# Altium schematic sheet External.SchDoc
size Letter; SheetNumber: 1; SheetTotal: 2
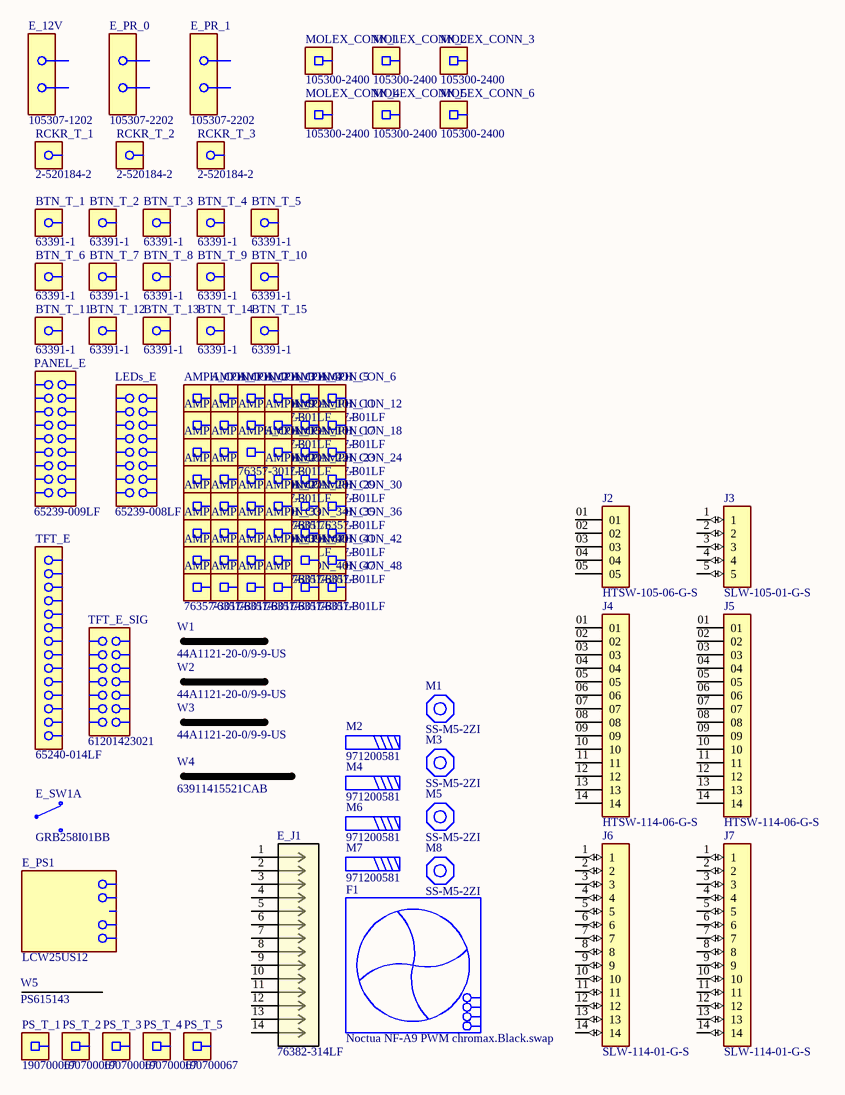
[diagram p0: External.SchDoc]

## Parts
AMPH_CON_1  76357-301LF  [76347-301LF-Footprint-1]
AMPH_CON_2  76357-301LF  [76347-301LF-Footprint-1]
AMPH_CON_3  76357-301LF  [76347-301LF-Footprint-1]
AMPH_CON_4  76357-301LF  [76347-301LF-Footprint-1]
AMPH_CON_5  76357-301LF  [76347-301LF-Footprint-1]
AMPH_CON_6  76357-301LF  [76347-301LF-Footprint-1]
AMPH_CON_7  76357-301LF  [76347-301LF-Footprint-1]
AMPH_CON_8  76357-301LF  [76347-301LF-Footprint-1]
AMPH_CON_9  76357-301LF  [76347-301LF-Footprint-1]
AMPH_CON_10  76357-301LF  [76347-301LF-Footprint-1]
AMPH_CON_11  76357-301LF  [76347-301LF-Footprint-1]
AMPH_CON_12  76357-301LF  [76347-301LF-Footprint-1]
AMPH_CON_13  76357-301LF  [76347-301LF-Footprint-1]
AMPH_CON_14  76357-301LF  [76347-301LF-Footprint-1]
AMPH_CON_15  76357-301LF  [76347-301LF-Footprint-1]
AMPH_CON_16  76357-301LF  [76347-301LF-Footprint-1]
AMPH_CON_17  76357-301LF  [76347-301LF-Footprint-1]
AMPH_CON_18  76357-301LF  [76347-301LF-Footprint-1]
AMPH_CON_19  76357-301LF  [76347-301LF-Footprint-1]
AMPH_CON_20  76357-301LF  [76347-301LF-Footprint-1]
AMPH_CON_21  76357-301LF  [76347-301LF-Footprint-1]
AMPH_CON_22  76357-301LF  [76347-301LF-Footprint-1]
AMPH_CON_23  76357-301LF  [76347-301LF-Footprint-1]
AMPH_CON_24  76357-301LF  [76347-301LF-Footprint-1]
AMPH_CON_25  76357-301LF  [76347-301LF-Footprint-1]
AMPH_CON_26  76357-301LF  [76347-301LF-Footprint-1]
AMPH_CON_27  76357-301LF  [76347-301LF-Footprint-1]
AMPH_CON_28  76357-301LF  [76347-301LF-Footprint-1]
AMPH_CON_29  76357-301LF  [76347-301LF-Footprint-1]
AMPH_CON_30  76357-301LF  [76347-301LF-Footprint-1]
AMPH_CON_31  76357-301LF  [76347-301LF-Footprint-1]
AMPH_CON_32  76357-301LF  [76347-301LF-Footprint-1]
AMPH_CON_33  76357-301LF  [76347-301LF-Footprint-1]
AMPH_CON_34  76357-301LF  [76347-301LF-Footprint-1]
AMPH_CON_35  76357-301LF  [76347-301LF-Footprint-1]
AMPH_CON_36  76357-301LF  [76347-301LF-Footprint-1]
AMPH_CON_37  76357-301LF  [76347-301LF-Footprint-1]
AMPH_CON_38  76357-301LF  [76347-301LF-Footprint-1]
AMPH_CON_39  76357-301LF  [76347-301LF-Footprint-1]
AMPH_CON_40  76357-301LF  [76347-301LF-Footprint-1]
AMPH_CON_41  76357-301LF  [76347-301LF-Footprint-1]
AMPH_CON_42  76357-301LF  [76347-301LF-Footprint-1]
AMPH_CON_43  76357-301LF  [76347-301LF-Footprint-1]
AMPH_CON_44  76357-301LF  [76347-301LF-Footprint-1]
AMPH_CON_45  76357-301LF  [76347-301LF-Footprint-1]
AMPH_CON_46  76357-301LF  [76347-301LF-Footprint-1]
AMPH_CON_47  76357-301LF  [76347-301LF-Footprint-1]
AMPH_CON_48  76357-301LF  [76347-301LF-Footprint-1]
BTN_T_1  63391-1  [63391-1-Footprint-1]
BTN_T_2  63391-1  [63391-1-Footprint-1]
BTN_T_3  63391-1  [63391-1-Footprint-1]
BTN_T_4  63391-1  [63391-1-Footprint-1]
BTN_T_5  63391-1  [63391-1-Footprint-1]
BTN_T_6  63391-1  [63391-1-Footprint-1]
BTN_T_7  63391-1  [63391-1-Footprint-1]
BTN_T_8  63391-1  [63391-1-Footprint-1]
BTN_T_9  63391-1  [63391-1-Footprint-1]
BTN_T_10  63391-1  [63391-1-Footprint-1]
BTN_T_11  63391-1  [63391-1-Footprint-1]
BTN_T_12  63391-1  [63391-1-Footprint-1]
BTN_T_13  63391-1  [63391-1-Footprint-1]
BTN_T_14  63391-1  [63391-1-Footprint-1]
BTN_T_15  63391-1  [63391-1-Footprint-1]
E_12V  105307-1202  [FP-105307-1202-MFG]
E_J1  76382-314LF  [76382-314LF_AMP]  (mechanical)
E_PR_0  105307-2202  [FP-105307-1202-MFG]
E_PR_1  105307-2202  [FP-105307-1202-MFG]
E_PS1  LCW25US12  [LCW25US12-Footprint-1]
E_SW1  GRB258I01BB  [GRB258I01BB-Footprint-1]  (part A of 2)
F1  Noctua NF-A9 PWM chromax.Black.swap  [Noctua NF-A9 PWM chromax.Black.swap-Footprint-1]
J2  HTSW-105-06-G-S  [SAMTEC_HTSW-105-06-G-S]  (mechanical)
J3  SLW-105-01-G-S  [SAMTEC-SLW-105-01-X-S]  (mechanical)
J4  HTSW-114-06-G-S  [SAMTEC_HTSW-114-06-G-S]  (mechanical)
J5  HTSW-114-06-G-S  [SAMTEC_HTSW-114-06-G-S]  (mechanical)
J6  SLW-114-01-G-S  [SAMTEC-SLW-114-01-X-S]  (mechanical)
J7  SLW-114-01-G-S  [SAMTEC-SLW-114-01-X-S]  (mechanical)
LEDs_E  65239-008LF  [65239-008LF-Footprint-1]
M1  SS-M5-2ZI  [SS-M5-2ZI-Footprint-1]
M2  971200581  [971400581-Footprint-1]
M3  SS-M5-2ZI  [SS-M5-2ZI-Footprint-1]
M4  971200581  [971400581-Footprint-1]
M5  SS-M5-2ZI  [SS-M5-2ZI-Footprint-1]
M6  971200581  [971400581-Footprint-1]
M7  971200581  [971400581-Footprint-1]
M8  SS-M5-2ZI  [SS-M5-2ZI-Footprint-1]
MOLEX_CONN_1  105300-2400  [105300-2400-Footprint-1]
MOLEX_CONN_2  105300-2400  [105300-2400-Footprint-1]
MOLEX_CONN_3  105300-2400  [105300-2400-Footprint-1]
MOLEX_CONN_4  105300-2400  [105300-2400-Footprint-1]
MOLEX_CONN_5  105300-2400  [105300-2400-Footprint-1]
MOLEX_CONN_6  105300-2400  [105300-2400-Footprint-1]
PANEL_E  65239-009LF  [65239-009LF-Footprint-1]
PS_T_1  190700067  [190700067-Footprint-1]
PS_T_2  190700067  [190700067-Footprint-1]
PS_T_3  190700067  [190700067-Footprint-1]
PS_T_4  190700067  [190700067-Footprint-1]
PS_T_5  190700067  [190700067-Footprint-1]
RCKR_T_1  2-520184-2  [9-520183-2-Footprint-1]
RCKR_T_2  2-520184-2  [9-520183-2-Footprint-1]
RCKR_T_3  2-520184-2  [9-520183-2-Footprint-1]
TFT_E  65240-014LF  [65240-014LF-Footprint-1]
TFT_E_SIG  61201423021  [61201423021-Footprint-1]
W1  44A1121-20-0/9-9-US  [44A1121-20-0_9-9-US-Footprint-1]
W2  44A1121-20-0/9-9-US  [44A1121-20-0_9-9-US-Footprint-1]
W3  44A1121-20-0/9-9-US  [44A1121-20-0_9-9-US-Footprint-1]
W4  63911415521CAB  [63911415521CAB-Footprint-1]
W5  PS615143  [PS615143-Footprint-1]

## Nets

Not connected (* = marked no-connect by the designer): E_J1 1 2 3 4 5 6 7 8 9 10 11 12 13 14; J2 01 02 03 04 05; J3 1 2 3 4 5; J4 01 02 03 04 05 06 07 08 09 10 11 12 13 14; J5 01 02 03 04 05 06 07 08 09 10 11 12 13 14; J6 1 2 3 4 5 6 7 8 9 10 11 12 13 14; J7 1 2 3 4 5 6 7 8 9 10 11 12 13 14

## Library data of the parts
AMPH_CON_1-AMPH_CON_48 = CMP-002-00102-1: Dubox® 2.54mm Pitch, Board to Board Connector, Crimp-to-Wire Contact; Voltage Rating: 1kV; Contact Resistance: 15mR; Max Current Rating: 3A; Wire Gauge (Min): 22AWG; Gender: Female; Wire/Cable Gauge: 30AWG; Connector Type: PCB,Crimp; Pitch: 2.54mm; Number of Rows: 1; Max Operating Temperature: 125°C; Length: 11.56mm; Lead Free: Lead Free; Radiation Hardening: No; RoHS Compliant: Yes; Orientation: Straight; Mounting Technology: Cable; Current Rating: 3A; Reach SVHC Compliant: Yes; Package Quantity: 15000; Wire Gauge (Max): 30AWG; Termination: Crimp; Series: DUBOX; Contact Plating: Gold,Tin,Matte; Contact Material: Bronze; Min Operating Temperature: -40°C; Contact Type: Signal; Packaging: Tape and Reel
BTN_T_1-BTN_T_15 = CMP-00008-1: Quick Disconnect Terminal 18-22AWG RCP 12.19mm 3.3mm Pre-Tin Loose Piece; Tab Thickness: 0.01inch; Tab Width: 0.093inch; Tab Length: 0.19inch; Insulation: Non-Insulated; Wire/Cable Diameter: 0.085inch; Plating: Tin; Wire Gauge (Max): 22AWG; Insulated Wire Support: Yes; Wire Gauge (Min): 18AWG; Wire/Cable Gauge: -18AWG; Wire/Cable Type: Discrete; Gender: Female; Contact Gender: Male; Radiation Hardening: No; Contact Plating: Tin; Series: Budget; Width: 3.05mm; Mating Tab Width: 0.093inch; Packaging: Bag; Orientation: Straight; RoHS Compliant: Yes; ELV: Compliant; Terminal Material: Brass; Material: Brass; Package Quantity: 1000; Mounting Technology: Free Hanging; Termination: Receptacle; Length: 12.19mm; Insulation Diameter: 0.085inch; Lead Free: Not Applicable
E_12V = CMP-002-00116-3: Nano-Fit Receptacle Housing; TPA Capable; 2.50mm Pitch; Single Row; 2 Circuit; Black; Number of Positions: 2; Color: Black; Gender: Receptacle; Series: Nano-Fit 105307; Contact Type: Non-Gendered; Packaging: Bulk; Connector Type: Receptacle; RoHS Compliant: Yes; Mounting Technology: Free Hanging; Termination: Crimp; Fastening Type: Latch; Number of Rows: 1
E_J1 = CMP-558-000000-2: Dubox®2.54mm, Board to Board Connector, Shrouded Header, Single Row, Right Angle.; Mfr_Name: Amphenol ICC; Contact Post Length: 3.4mm; Pitch: 2.54mm; Voltage Rating: 1kV; Connector Type: Male Pin; Number of Positions: 14; Gender: Male; Current Rating: 3A; Copyright: Copyright (C) 2023 Ultra Librarian. All rights reserved.; Contact Plating: Gold,GXT; Package Quantity: 16; Contact Mating Length: 0.197inch; Width: 9.34mm; Manufacturer_Part_Number: 76382-314LF; Number of Rows: 1; Fastening Type: Friction; Series: DUBOX™, MezzSelect™, Basics+; Mounting Technology: Through Hole; Contact Type: Male Pin; Packaging: Rail/Tube; Contact Material: Bronze; Design Item ID: 76382-314LF; Termination: Solder; Max Operating Temperature: 125°C; Length: 35.38mm; Color: Blue; Housing Color: Blue; RefDes: RefDes; Source: 76382-314LF.SchLib; Max Voltage Rating (AC): 1kV; Type: DEV; RoHS Compliant: Yes; Lead Free: Lead Free; Number of Contacts: 14; Radiation Hardening: No; Orientation: Right Angle; Min Operating Temperature: -40°C; Housing Material: Thermoplastic
E_PR_0 E_PR_1 = CMP-002-00117-2: Nano-Fit Receptacle Housing TPA Capable 2.5mm Pitch Single Row 2 Circuits Natural Bag; Connector Type: Receptacle,Non-Gendered; Number of Positions: 2; Color: Natural; Contact Type: Non-Gendered; Termination: Crimp; Fastening Type: Latch; RoHS Compliant: Yes; Number of Rows: 1; Packaging: Bulk; Gender: Receptacle; Mounting Technology: Free Hanging; Series: Nano-Fit 105307
E_PS1 = CMP-019-00052-1: Power Supply, AC-DC, Enclosed, Industrial, 25W, 12V, LCW25 Series
E_SW1 = CMP-011-00015-1: Rocker Switch, GRB, SPDT, (ON)-OFF-(ON), Convex, Black, IP56, 20A, 125VAC, .250" QC; Voltage Rating (AC): 125V; Mechanical Life: 100000Cycles; Switch Function: Mom-Off-Mom; Ratings: IP56,Water Resistant; Illumination Type: Illuminated; Mounting Technology: Panel,Snap in; Package Quantity: 1000; RoHS Compliant: Yes; Max Operating Temperature: 85°C; Termination: Quick Connect; Min Operating Temperature: -20°C; Series: GRB; Packaging: Bulk; Current Rating: 20A; Throw Configuration: SPDT
F1 = CMP-00030-00001-3: Premium quiet fan, 92x92x25mm, 12V, 4-pin PWM, max. 2000 RPM, max. 22.8 dB(A), >150,000 h MTTF
J2 = CMP-576-000000-2: Board Connector, 5 Contact(s), 1 Row(s), Male, Straight, 0.1 inch Pitch, Solder Terminal; Manufacturer Series: HTSW; Mixed Contacts: No; Mating Information: MULTIPLE MATING PARTS AVAILABLE; Number of Contacts: 5; Number of Rows Loaded: 1; MF: {'manufacturer': u'Samtec'}; Additional Feature: E.L.P.; Option: General Purpose; Mounting Style: STRAIGHT; Contact Material: Bronze; Package: None; Termination: Solder; Value: *; Filter Feature: No; Availability: Unavailable; RoHS Compliant: Yes; Reach SVHC Compliant: Yes; Mounting Technology: Board; Contact Gender: Male; IEC Conformance: No; Contact Finish - Mating: GOLD (10) OVER NICKEL (50); MP: HTSW-105-06-G-S; Connector Type: BOARD CONNECTOR; Design Item ID: HTSW-105-06-G-S; Source: HTSW-105-06-G-S.SchLib; Terminal Pitch: 2.54mm; MIL Conformance: No; Price: None; DIN Conformance: No
J3 = CMP-574-000000-2: Board Connector, 5 Contact(s), 1 Row(s), Female, Straight, 0.1 inch Pitch, Solder Terminal, Black Insulator, Socket; Contact Style: BELLOWED TYPE; MIL Conformance: No; PCB Contact Pattern: RECTANGULAR; Number of Rows Loaded: 1; Contact Resistance: 10mR; Reference Standard: UL; Number of Contacts: 5; MF: {'manufacturer': u'Samtec'}; Plating Thickness: 20uin; Option: General Purpose; Body Length: 0.5inch; Reliability: COMMERCIAL; Insertion Force-Max: 3.336N; Mating Information: MULTIPLE MATING PARTS AVAILABLE; Rated Current (Signal): 5.2A; Body Depth: 0.18inch; JESD-609 Code: e4; Insulation Material: Glass; MP: SAMTEC-SLW-105-01-X-S; Mounting Technology: Board; Connector Type: BOARD CONNECTOR; Contact Gender: Female; Mixed Contacts: No; Body/Shell Style: SOCKET; Contact Finish - Mating: GOLD (20) OVER NICKEL (50); Value: *; Terminal Length: 0.115inch; DIN Conformance: No; IEC Conformance: No; Reach SVHC Compliant: Yes; Package: None; Filter Feature: No; Min Operating Temperature: -55°C; Source: SLW-105-01-G-S.SchLib; Price: None; Mating Contact Pitch: 0.1inch; Termination: Solder; Insulation Color: Black; Max Operating Temperature: 125°C; RoHS Compliant: Yes; Mounting Style: STRAIGHT; Terminal Pitch: 2.54mm; Design Item ID: SAMTEC-SLW-105-01-X-S; Number Of PCB Rows: 1; Contact Finish - Termination: Gold (Au) - with Nickel (Ni) barrier; Contact Pattern: RECTANGULAR; Number Of Connectors: 1; Availability: Unavailable
J4 J5 = CMP-575-000000-2: Board Connector, 14 Contact(s), 1 Row(s), Male, Straight, 0.1 inch Pitch, Solder Terminal; Manufacturer Series: HTSW; MF: {'manufacturer': u'Samtec'}; MIL Conformance: No; Additional Feature: E.L.P.; Mating Information: MULTIPLE MATING PARTS AVAILABLE; Number of Rows Loaded: 1; Option: General Purpose; Number of Contacts: 14; JESD-609 Code: e4; Contact Finish - Termination: GOLD (10) OVER NICKEL; Value: *; Mounting Style: STRAIGHT; Price: None; Contact Gender: Male; Contact Finish - Mating: GOLD (10) OVER NICKEL; Mounting Technology: Board; Package: None; Source: HTSW-114-06-G-S.SchLib; DIN Conformance: No; IEC Conformance: No; Contact Material: Bronze; Filter Feature: No; MP: HTSW-114-06-G-S; Terminal Pitch: 2.54mm; Termination: Solder; Availability: Unavailable; Connector Type: BOARD CONNECTOR; Reach SVHC Compliant: Yes; RoHS Compliant: Yes; Mixed Contacts: No; Design Item ID: HTSW-114-06-G-S
J6 J7 = CMP-573-000000-2: Board Connector, 14 Contact(s), 1 Row(s), Female, Straight, 0.1 inch Pitch, Solder Terminal, Black Insulator, Socket; Manufacturer Series: SLW; Insertion Force-Max: 3.336N; MF: {'manufacturer': u'Samtec'}; Body Length: 1.4inch; Mating Information: MULTIPLE MATING PARTS AVAILABLE; Contact Pattern: RECTANGULAR; Filter Feature: No; Reference Standard: UL; Body Depth: 0.18inch; Plating Thickness: 20uin; Contact Style: BELLOWED TYPE; Number of Rows Loaded: 1; Contact Resistance: 10mR; Reliability: COMMERCIAL; Option: General Purpose; Rated Current (Signal): 5.2A; Number of Contacts: 14; Mounting Style: STRAIGHT; Body/Shell Style: SOCKET; JESD-609 Code: e4; Value: *; Max Operating Temperature: 125°C; Insulation Color: Black; Insulation Material: Glass; Availability: Unavailable; Price: None; Mating Contact Pitch: 0.1inch; Contact Finish - Mating: GOLD (20) OVER NICKEL (50); Connector Type: BOARD CONNECTOR; Terminal Pitch: 2.54mm; Termination: Solder; MIL Conformance: No; Contact Finish - Termination: Gold (Au) - with Nickel (Ni) barrier; RoHS Compliant: Yes; PCB Contact Pattern: RECTANGULAR; MP: SAMTEC-SLW-114-01-X-S; Mixed Contacts: No; IEC Conformance: No; Design Item ID: SAMTEC-SLW-114-01-X-S; Source: SLW-114-01-G-S.SchLib; Package: None; Contact Gender: Female; Mounting Technology: Board; Number Of PCB Rows: 1; Reach SVHC Compliant: Yes; DIN Conformance: No; Terminal Length: 0.115inch; Min Operating Temperature: -55°C; Number Of Connectors: 1
LEDs_E = CMP-002-00108-1: Dubox® 2.54mm, Crimp-to-Wire Housing, Double Row, 16 Position.; Wire Gauge (Max): 22AWG; Voltage Rating: 1kV; Current Rating: 3A; Number of Positions: 16; Insulation Resistance: 100GR; Gender: Receptacle; Row Spacing: 0.1inch; Wire Gauge (Min): 30AWG; Mounting Technology: Free Hanging,Cable; Pitch: 2.54mm; Termination: Crimp; Width: 6.59mm; Length: 20.24mm; Contact Material: Nickel,Gold; Contact Gender: Female; Housing Material: Thermoplastic; Lead Free: Lead Free; Reach SVHC Compliant: Yes; Orientation: Straight; Package Quantity: 500; Number of Rows: 2; Number of Contacts: 16; Depth: 14.01mm; Packaging: Bulk; Connector Type: Receptacle; Color: Blue; Max Voltage Rating (AC): 1kV; Series: DUBOX™, MezzSelect™, Basics+; Contact Type: Female Socket; Housing Color: Blue
M1 M3 M5 M8 = CMP-00028-00008-2: Self-Clinching Nuts - Types S SS CLS CLSS SP - Metric
M2 M4 M6 M7 = CMP-00028-00011-1: WA-SSTIE Steel Spacer Stud Metric Thread int./ext.
MOLEX_CONN_1-MOLEX_CONN_6 = CMP-00009-1: Nano-Fit Crimp Terminal, Female, 0.76µm Gold (Au) Plating, Lubricated, 20-22 AWG
PANEL_E = CMP-002-00109-1: Dubox® 2.54mm, Crimp-to-Wire Housing, Double Row, 18 Position.; Number of Positions: 18; Connector Type: Receptacle; Packaging: Bulk; Number of Rows: 2; Termination: Crimp; Mounting Technology: Free Hanging; Series: DUBOX™, MezzSelect™, Basics+; Color: Blue; Contact Type: Female Socket
PS_T_1-PS_T_5 = CMP-002-00111-1: Ring Terminal, 2mm2; Manufacturer Series: 19070; Wire/Cable Gauge: 14AWG; RoHS Compliant: Yes; Reach SVHC Compliant: Yes; Terminal and Terminal Block Type: RING TERMINAL; Wire Cross Section: 2mm2
RCKR_T_1-RCKR_T_3 = CMP-002-00107-1: Quick Disconnect Terminal 18-22AWG Brass Red Translucent RCP 21.71mm Tin Loose; Mating Tab Width: 6.35mm; Voltage Rating: 600V; Wire Gauge (Max): 18AWG; Insulation Diameter: 0.135inch; Wire Gauge (Min): 22AWG; Tab Thickness: 0.032inch; Insulated Wire Support: Yes; Tab Width: 0.25inch; Gender: Female; Wire/Cable Diameter: 3.43mm; Insulation: Insulated; Wire/Cable Type: Discrete; Mounting Technology: Free Hanging; Package Quantity: 1000; Max Operating Temperature: 105°C; Series: Ultra-Fast; Contact Plating: Tin; Length: 0.855inch; Material: Brass; Plating: Tin; Radiation Hardening: No; ELV: Compliant; Color: Red,Clear; Termination: Receptacle; RoHS Compliant: Yes; Flammability Rating: UL94 V-2; Packaging: Loose Piece; Body Material: Brass; Body Plating: Tin; Depth: 10.38mm; Insulation Color: Red; Insulation Material: Nylon; Orientation: Straight; Size: 0.032inch; Terminal Material: Brass; Wire/Cable Gauge: 18AWG
TFT_E = CMP-002-00106-1: Dubox® 2.54mm Pitch, Board to Board Connector, Crimp-to-Wire Housing, Single Row.; Wire Gauge (Max): 22AWG; Max Voltage Rating (AC): 1kV; Gender: Female; Number of Positions: 14; Wire Gauge (Min): 30AWG; Connector Type: Receptacle; Mounting Technology: Free Hanging; Length: 35.48mm; Package Quantity: 300; Number of Rows: 1; Voltage Rating: 1kV; Pitch: 2.54mm; Series: DUBOX™, MezzSelect™, Basics+; Lead Free: Lead Free; Housing Color: Blue; Packaging: Bulk; Max Operating Temperature: 125°C; Housing Material: Thermoplastic; Contact Type: Female Socket; Color: Blue; Width: 3.1mm; Termination: Crimp; RoHS Compliant: Yes; Number of Contacts: 14; Radiation Hardening: No; Min Operating Temperature: -65°C; Orientation: Straight; Depth: 14.01mm
TFT_E_SIG = CMP-002-00105-1: 6120 Series 2.54mm Pitch Surface Mount IDC Connector; Socket; 14 Way; 2 Row; Connector Type: Receptacle,IDC; Pitch: 0.1inch; Number of Positions: 14; Wire/Cable Gauge: 28AWG; Wire/Cable Type: Ribbon; Gender: Receptacle; Contact Type: Female Socket; Series: WR-BHD; Color: Black; Contact Plating: Gold; Mounting Technology: Free Hanging; Termination: IDC; Packaging: Tray; Number of Rows: 2; Contact Material: Copper; Number of Contacts: 14; Row Spacing: 0.1inch
W1-W3 = CMP-00005-1: Multi-Conductor Cables 20awg Twisted Pair PRICE PER FT; Outside Diameter: 3.76mm; Jacket Material: Polyvinyl; Voltage Rating (AC): 600V; Wire/Cable Type: Spec 44; Wire/Cable Diameter: 1.4mm; Wire/Cable Color: Black; Conductor Material: Copper; Stranding: 19 x 32; Number of Conductors: 2; Shielding: Shielded; Package Quantity: 1; Color: White; Packaging: Spool; Insulation Material: Polylalkene; Max Operating Temperature: -150°C; Min Operating Temperature: -65°C; Voltage Rating: 600V; Wire/Cable Gauge: 20AWG; Lead Free: Not Applicable; ELV: Non-Compliant
W4 = CMP-00010-1: Unshld Ribbon Cable, 14 Cond, 28AWG, 1M Rohs Compliant: Yes; Shielding: Unshielded; First Conductor Mark: Red; Wire/Cable Type: Flat; Current Rating: 1A; Number of Conductors: 14; Conductor Material: Copper; Voltage: 300V; Insulation Resistance: 100MR; Insulation Material: PVC; Min Operating Temperature: -25°C; Series: WR-CAB; Wire/Cable Gauge: 28AWG; Color: Grey; Max Operating Temperature: 105°C; RoHS Compliant: Yes
W5 = CMP-00012-1: 6 Foot 14/3 cord with U Ground NEMA 5-15 plug and pigtail end